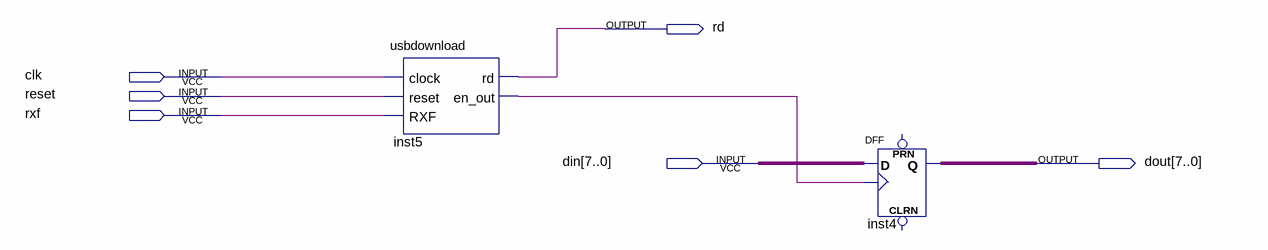
[diagram p0: schematic sheet]
// Quartus schematic chuanshu.bdf as structural Verilog: 2 symbols, 6 pins
module chuanshu (
  input  clk,
  input  reset,
  input  rxf,
  input  [7:0] din,
  output rd,
  output [7:0] dout
);

  wire inst5_en_out;

  usbdownload inst5 (.clock(clk), .reset(reset), .RXF(rxf), .rd(rd), .en_out(inst5_en_out));
  DFF inst4[7:0] (.CLK(inst5_en_out), .D(din), .Q(dout));  // open: CLRN, PRN
endmodule
